# Altium schematic sheet auido.SchDoc
size A; SheetNumber: 4; SheetTotal: 5
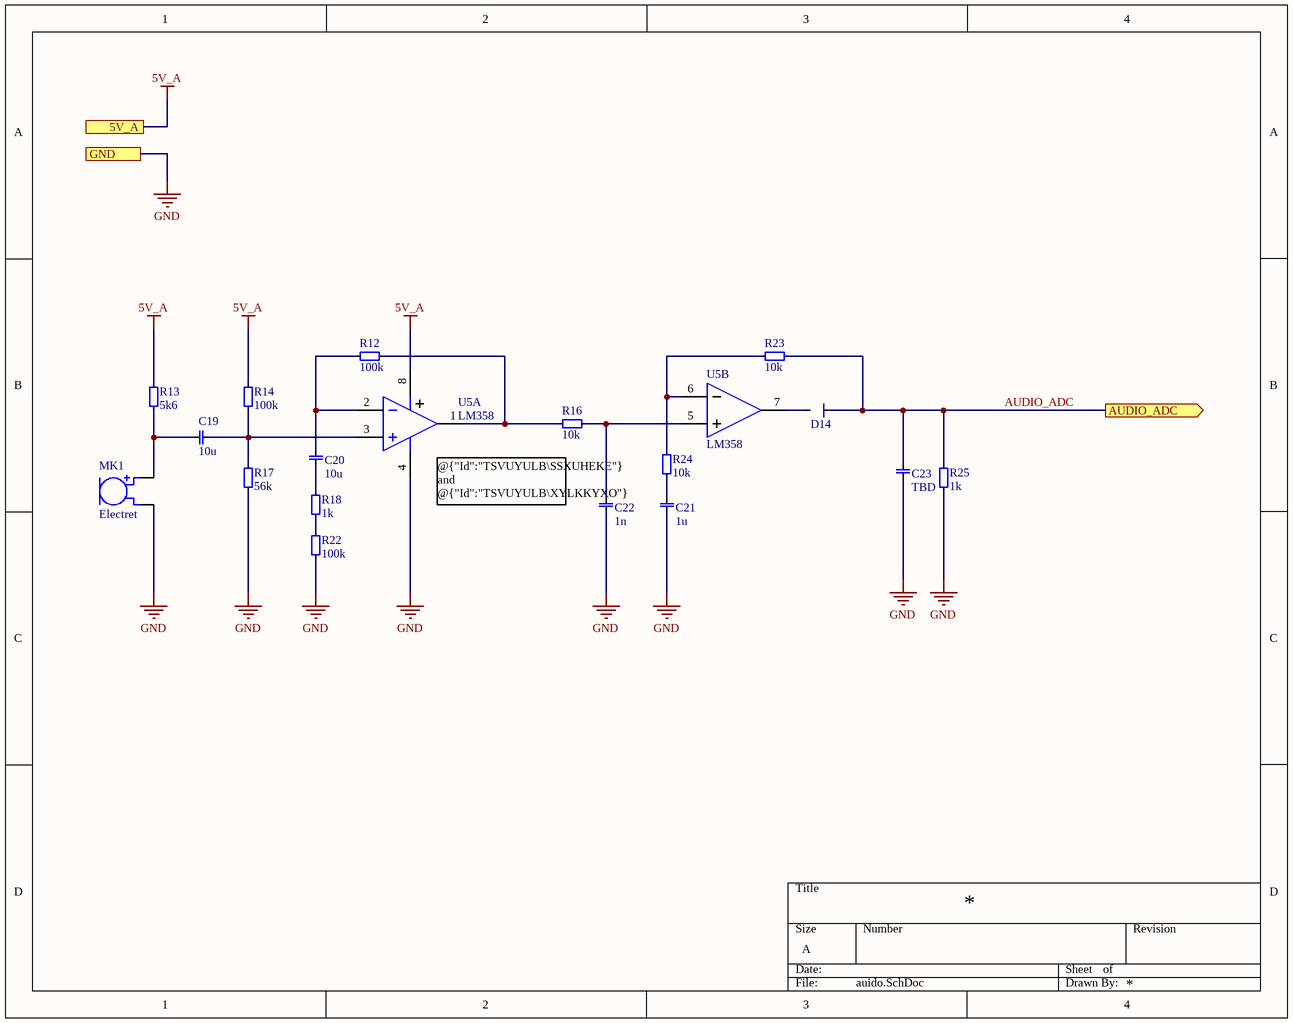
[diagram p0: auido.SchDoc]

## Parts
C19  value 10u  [0603 cap]  (hidden comment: 0603, capacitor)
C20  value 10u  [0603 cap]  (hidden comment: 0603, capacitor)
C21  value 1u  [0603 cap]  (hidden comment: 0603, capacitor)
C22  value 1n  [0603 cap]  (hidden comment: 0603, capacitor)
C23  value TBD  [0603 cap]  (hidden comment: 0603, capacitor)
D14  Diode, SMD  [SOD323]  (value not drawn)
MK1  Electret  [ElectretMic_9.7mm_6.7mm]
R12  value 100k  [0603]  (hidden comment: 0603, resistor)
R13  value 5k6  [0603]  (hidden comment: 0603, resistor)
R14  value 100k  [0603]  (hidden comment: 0603, resistor)
R16  value 10k  [0603]  (hidden comment: 0603, resistor)
R17  value 56k  [0603]  (hidden comment: 0603, resistor)
R18  value 1k  [0603]  (hidden comment: 0603, resistor)
R22  value 100k  [0603]  (hidden comment: 0603, resistor)
R23  value 10k  [0603]  (hidden comment: 0603, resistor)
R24  value 10k  [0603]  (hidden comment: 0603, resistor)
R25  value 1k  [0603]  (hidden comment: 0603, resistor)
U5  LM358  [SOIC8]  (parts A,B of 2)

## Ports
5V_A, AUDIO_ADC (out), GND

## Nets
5V_A: R13.0 R14.0 U5.8(V+) ; port 5V_A
GND: C21.0 C22.0 C23.1 MK1.2 R17.1 R22.1 R25.1 U5.4(V-) ; port GND
AUDIO_ADC: C23.0 D14.1 R23.1 R25.0 ; port AUDIO_ADC
NetC19_0: C19.0 R14.1 R17.0 U5.3(IN+)
NetC19_1: C19.1 MK1.1 R13.1
NetC20_0: C20.0 R18.0
NetC20_1: C20.1 R12.0 U5.2(IN-)
NetC21_1: C21.1 R24.1
NetC22_1: C22.1 R16.1 U5.5(IN+)
NetD14_2: D14.2 U5.7(OUT2)
NetR12_1: R12.1 R16.0 U5.1(OUT1)
NetR18_1: R18.1 R22.0
NetR23_0: R23.0 R24.0 U5.6(IN-)

## Notes on the sheet
- (near U5) @{"Id":"TSVUYULB\SSXUHEKE"} and @{"Id":"TSVUYULB\XYLKKYXO"} should have a time constant of 110 ms (2.2 1/20 Hz)

## Library data of the parts
MK1 = Electret Mic: D9.7mm H6.7mm, Electrokit art nr: 40290007
U5 = LM358: Dual FET-Input Operational Amplifier; Part Number: LM358P; Value: 595-LM358P; Cost (kr): 4,04; Order code: *
C19-C23 = 0603, capacitor: Order number: *